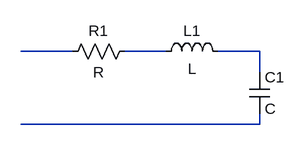
[diagram p0: schematic pasabajos_activo.asc]
pasabajos_activo.asc, the LTspice schematic file:
Version 4
SHEET 1 880 680
WIRE 96 80 16 80
WIRE 240 80 176 80
WIRE 384 80 320 80
WIRE 384 112 384 80
WIRE 384 192 384 176
WIRE 384 192 16 192
SYMBOL res 192 64 R90
WINDOW 0 0 56 VBottom 2
WINDOW 3 32 56 VTop 2
SYMATTR InstName R1
SYMBOL ind 224 96 R270
WINDOW 0 32 56 VTop 2
WINDOW 3 5 56 VBottom 2
SYMATTR InstName L1
SYMBOL cap 368 112 R0
SYMATTR InstName C1

The netlist it stands for:
* pasabajos_activo.asc
R1 N002 N001 R
L1 N002 N003 L
C1 N003 N004 C
.backanno
.end